# EAGLE schematic HCLA (EAGLE 6.5.0)
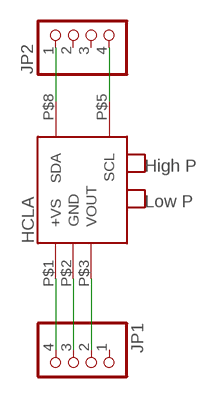
[diagram p0: schematic, sheet 1]

## Parts
JP1  PINHD-1X4  [1X04]
JP2  PINHD-1X4  [1X04]
U$1  HCLA  [HCLA]

## Nets
+VS: JP1.4 U$1.P$1(+VS)
GND: JP1.3 U$1.P$2(GND)
SCL: JP2.4 U$1.P$5(SCL)
SDA: JP2.1 U$1.P$8(SDA)
VOUT: JP1.2 U$1.P$3(VOUT)
Unconnected: JP1.1 JP2.2 JP2.3

## Library data of the parts
JP1 JP2 = pinhead:PINHD-1X4: PIN HEADER
U$1 = HCLA:HCLA